# EAGLE schematic Franzininho (EAGLE 7.5.0)
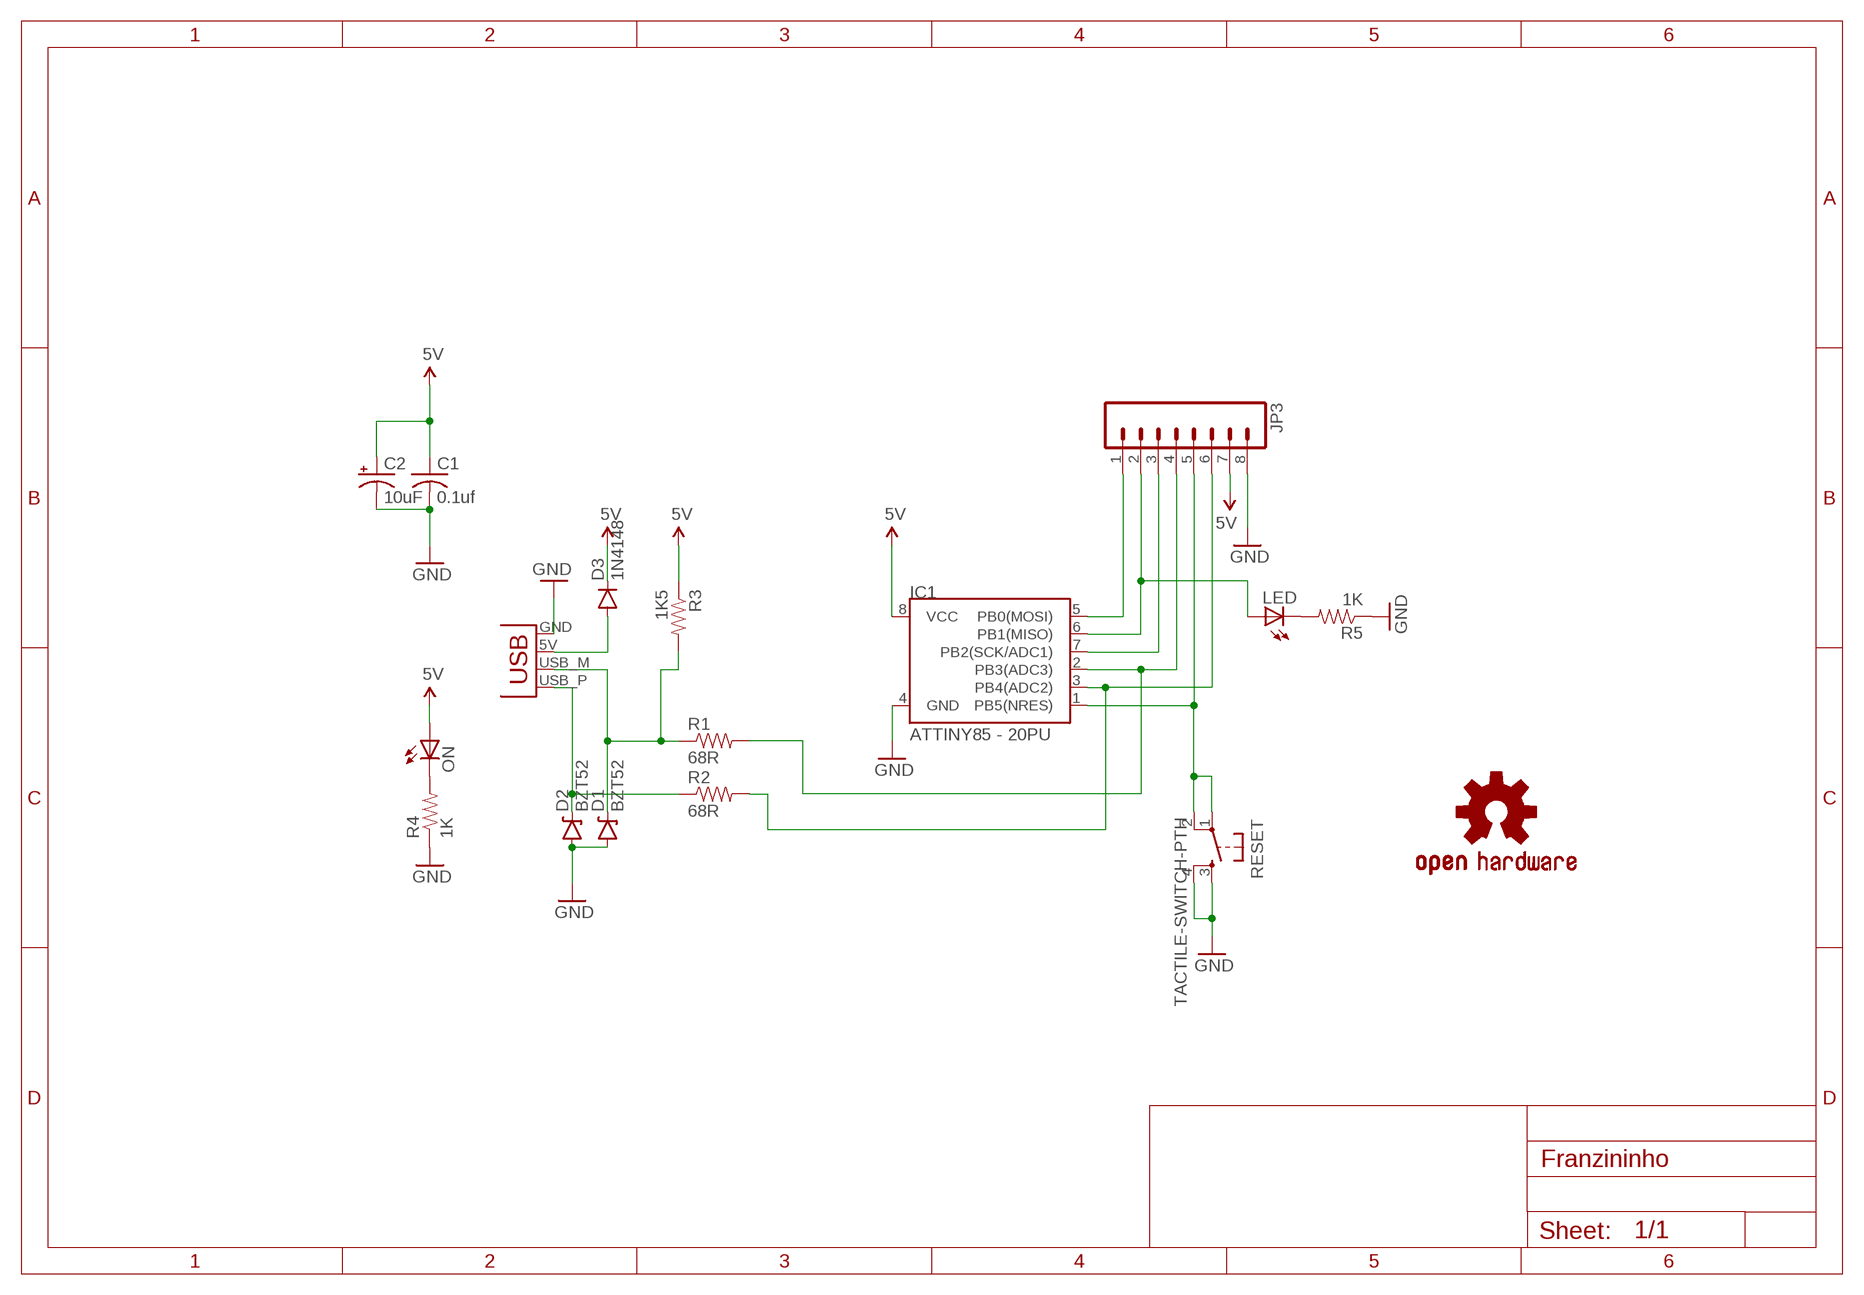
[diagram p0: schematic, sheet 1]

## Parts
C1  0.1uf  C-US025-025X050  [C025-025X050]
C2  10uF  CPOL-USE2,5-6E  [E2,5-6E]
D1  BZT52  DIODE-ZENER  [DIODE-BZT52]
D2  BZT52  DIODE-ZENER  [DIODE-BZT52]
D3  1N4148  DIODE1N4148  [DIODE-1N4148]
IC1  ATTINY85 - 20PU  ATTINY45TINY45-20-DIP  [DIP08]
JP3  M08  [1X08_ROUND]
LED  LED3MM  [LED3MM]
LOGO1  OSHW-LOGOL  [OSHW-LOGO-L]
ON  LED3MM  [LED3MM]
R1  68R  RESISTORPTH-1/4W  [AXIAL-0.4]
R2  68R  RESISTORPTH-1/4W  [AXIAL-0.4]
R3  1K5  RESISTORPTH-1/4W  [AXIAL-0.4]
R4  1K  RESISTORPTH-1/4W  [AXIAL-0.4]
R5  1K  RESISTORPTH-1/4W  [AXIAL-0.4]
RESET  TACTILE-SWITCH-PTH  [TAC-SWITCH-PTH]
X1  USBPCB  [USB-A-PCB]

## Nets
5V: C1.1 C2.+ D3.C IC1.8(VCC) JP3.7 ON.A R3.P$1
GND: C1.2 C2.- D1.A D2.A IC1.4(GND) JP3.8 R4.P$1 R5.P$1 RESET.3 RESET.4 X1.GND
N$1: IC1.2(PB3(ADC3)) JP3.4 R1.P$2
N$2: IC1.6(PB1(MISO)) JP3.2 LED.A
N$3: IC1.5(PB0(MOSI)) JP3.1
N$4: D3.A X1.5V(VBUS)
N$5: IC1.7(PB2(SCK/ADC1)) JP3.3
N$6: IC1.3(PB4(ADC2)) JP3.6 R2.P$2
N$8: IC1.1(PB5(NRES)) JP3.5 RESET.1 RESET.2
N$10: D1.C R1.P$1 R3.P$2 X1.USB_M(D-)
N$11: D2.C R2.P$1 X1.USB_P(D+)
N$12: LED.K(C) R5.P$2
N$17: ON.K(C) R4.P$2

## Library data of the parts
C1 = adafruit:C-US: CAPACITOR, American symbol
C2 = adafruit:CPOL-US: POLARIZED CAPACITOR, American symbol
D1 D2 = SparkFun-DiscreteSemi:DIODE-ZENER: Zener Diode Production Part - 8199 3.4V Zener Voltage; PROD-ID: DIO-08199
D3 = SparkFun-DiscreteSemi:DIODE: Diode These are standard reverse protection diodes and small signal diodes. SMA package can handle up to about 1A. SOD-323 can handle about 200mA. What the SOD-323 package when ordering, there are some mfgs out there that are 5-pin packages.; PROD_ID: DIO-08378
IC1 = SparkFun-DigitalIC:ATTINY45: Atmel 8-pin 2/4/8kB flash uC; PROD_ID: IC-09439; VALUE: TINY45-20-DIP
JP3 = SparkFun-Connectors:M08: Header 8 Standard 8-pin 0.1" header. Use with straight break away headers (SKU : PRT-00116), right angle break away headers (PRT-00553), swiss pins (PRT-00743), machine pins (PRT-00117), and female headers (PRT-00115).; PROD_ID: CONN-08437
LED ON = adafruit:LED: LED OSRAM: - CHIPLED LG R971, LG N971, LY N971, LG Q971, LY Q971, LO R971, LY R971 LH N974, LH R974 LS Q976, LO Q976, LY Q976 LO Q996 - Hyper CHIPLED LW Q18S LB Q993, LB Q99A, LB R99A - SideLED LS A670, LO A670, LY A670, LG A670, LP A670 LB A673, LV A673, LT A673, LW A673 LH A674 LY A675 LS A676, LA A676, LO A676, LY A676, LW A676 LS A679, LY A679, LG A679 - Hyper Micro SIDELED® LS Y876, LA Y876, LO Y876, LY Y876 LT Y87S - SmartLED LW L88C, LW L88S LB L89C, LB L89S, LG L890 LS L89K, LO L89K, LY L89K LS L896, LA L896, LO L896, LY L896 - TOPLED LS T670, LO T670, LY T670, LG T670, LP T670 LSG T670, LSP T670, LSY T670, LOP T670, LYG T670 LG T671, LOG T671, LSG T671 LB T673, LV T673, LT T673, LW T673 LH T674 LS T676, LA T676, LO T676, LY T676, LB T676, LH T676, LSB T676, LW T676 LB T67C, LV T67C, LT T67C, LS T67K, LO T67K, LY T67K, LW E67C LS E67B, LA E67B, LO E67B, LY E67B, LB E67C, LV E67C, LT E67C LW T67C LS T679, LY T679, LG T679 LS T770, LO T770, LY T770, LG T770, LP T770 LB T773, LV T773, LT T773, LW T773 LH T774 LS E675, LA E675, LY E675, LS T675 LS T776, LA T776, LO T776, LY T776, LB T776 LHGB T686 LT T68C, LB T68C - Hyper Mini TOPLED® LB M676 - Mini TOPLED Santana® LG M470 LS M47K, LO M47K, LY M47K Source: http://www.osram.convergy.de/
LOGO1 = SparkFun-Aesthetics:OSHW-LOGO: Open Source Hardware Logo This logo indicates the piece of hardware it is found on incorporates a OSHW license and/or adheres to the definition of open source hardware found here: http://freedomdefined.org/OSHW
R1-R5 = SparkFun-Passives:RESISTOR: Resistor Basic schematic elements and footprints for 0603, 1206, and PTH resistors.
RESET = GeekAmmo:TACTILE-SWITCH: Tactile Switch 4 Pins, SPST NO
X1 = SparkFun:USB: USB Connectors USB-B-PTH is fully proven SKU : PRT-00139 USB-miniB is fully proven SKU : PRT-00587 USB-A-PCB is untested. USB-A-H is throughly reviewed, but untested. Spark Fun Electronics SKU : PRT-00437 USB-B-SMT is throughly reviewed, but untested. Needs silkscreen touching up. USB-A-S has not been used/tested USB-MB-H has not been used/tested